# EAGLE design SwitchDemo4 (EAGLE 9.1.3)
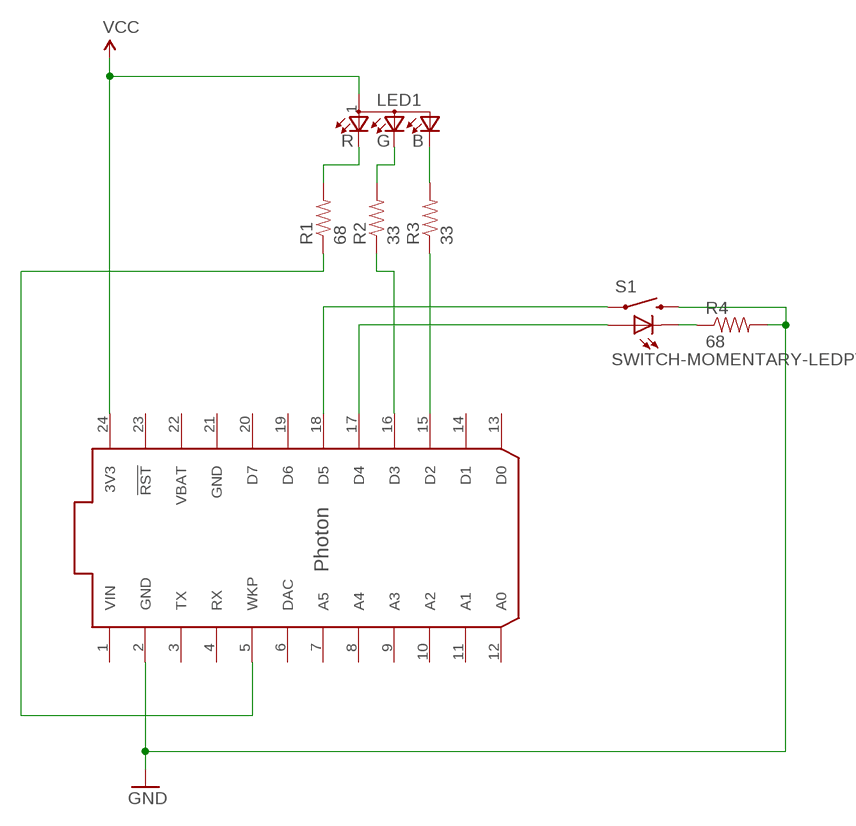
[diagram p0: schematic, sheet 1]

## Parts
LED1  LED-RGB-CREE-SMD  [LED-RGB-CREE-SMD]
R1  68  RES-68-0603.DEV  [0603-RES]
R2  33  RES-33-0603.DEV  [0603-RES]
R3  33  RES-33-0603.DEV  [0603-RES]
R4  68  RES-68-0603.DEV  [0603-RES]
S1  SWITCH-MOMENTARY-LEDPTH  [TACTILE-PTH-LED-12MM]
U$1  PHOTON  [PHOTON-SMD]

## Nets
BLED: LED1.2(B) R3.2
D2: R3.1 U$1.15(D2)
D3: R2.1 U$1.16(D3)
D4: S1.A U$1.17(D4)
D5: S1.4 U$1.18(D5)
GLED: LED1.3(G) R2.2
GND: R4.2 S1.2 U$1.2(GND)
RLED: LED1.4(R) R1.2
SLED: R4.1 S1.C
VCC: LED1.1(A) U$1.24(3V3)
WKP: R1.1 U$1.5(WKP)
Unconnected: U$1.3(TX) U$1.4(RX) U$1.6(DAC) U$1.7(A5) U$1.8(A4) U$1.9(A3) U$1.10(A2) U$1.11(A1) U$1.12(A0) U$1.13(D0) U$1.14(D1) U$1.19(D6) U$1.20(D7) U$1.23(!RST)

## Power pins joined to a net without a drawn wire
GND: U$1.21(GND)
VBAT: U$1.22(VBAT)
VIN: U$1.1(VIN)

## Library data of the parts
LED1 = rickk2:LED-RGB-CREE-SMD: LED RGB DIFFUSED 4SMD $ 0.35 Cree CLMVB-FKA-CFHEHLCBB7A363 2mm 4-PLCC common anode RGB LED https://www.digikey.com/product-detail/en/cree-inc/CLMVB-FKA-CFHEHLCBB7A363/CLMVB-FKA-CFHEHLCBB7A363CT-ND/6138627 Red=68 ohm, Green/Blue=33 ohm @ 3.3V
R1 R4 = rickk2:RES-68-0603.DEV: https://www.digikey.com/product-detail/en/panasonic-electronic-components/ERJ-3EKF68R0V/P68.0HCT-ND/1746805 Panasonic SMD 0603 1% 1/10W
R2 R3 = rickk2:RES-33-0603.DEV: https://www.digikey.com/product-detail/en/panasonic-electronic-components/ERJ-3EKF33R0V/P33.0HCT-ND/1746765 Panasonic SMD 0603 1% 1/10W
S1 = rickk2:SWITCH-MOMENTARY-LED: EZ is for Kits. There is no tStop (covering up the top side of the pads with mask). This helps the beginner see which side they should be soldering too. Red $2.10 https://www.sparkfun.com/products/10442 Also green, blue, and white Available in orange but I don't have that one
U$1 = rickk2:PHOTON: PPTC121LFBN-RC $ 0.98 Description CONN HEADER FEM 12POS.1" SGL TIN Expanded Description 12 Position Header Connector 0.100" (2.54mm) Through Hole Tin Digikey: S6100-ND Sullins: PPTC121LFBN-RC https://www.digikey.com/product-detail/en/sullins-connector-solutions/PPTC121LFBN-RC/S6100-ND/807231 SMD version $ 1.69 12 Position Header, Top or Bottom Entry Connector 0.100" (2.54mm) Surface Mount Tin Digikey: S5604-ND Sullins: NPTC121KFXC-RC Nylon/Phosphor Bronze / Tin / 0.1” / 12 Pos / 1 Row / Single Row SMT / SMT Single Row Pin 1 Left / ROHS Compliant https://www.digikey.com/product-detail/en/sullins-connector-solutions/NPTC121KFXC-RC/S5604-ND/776062

## Board
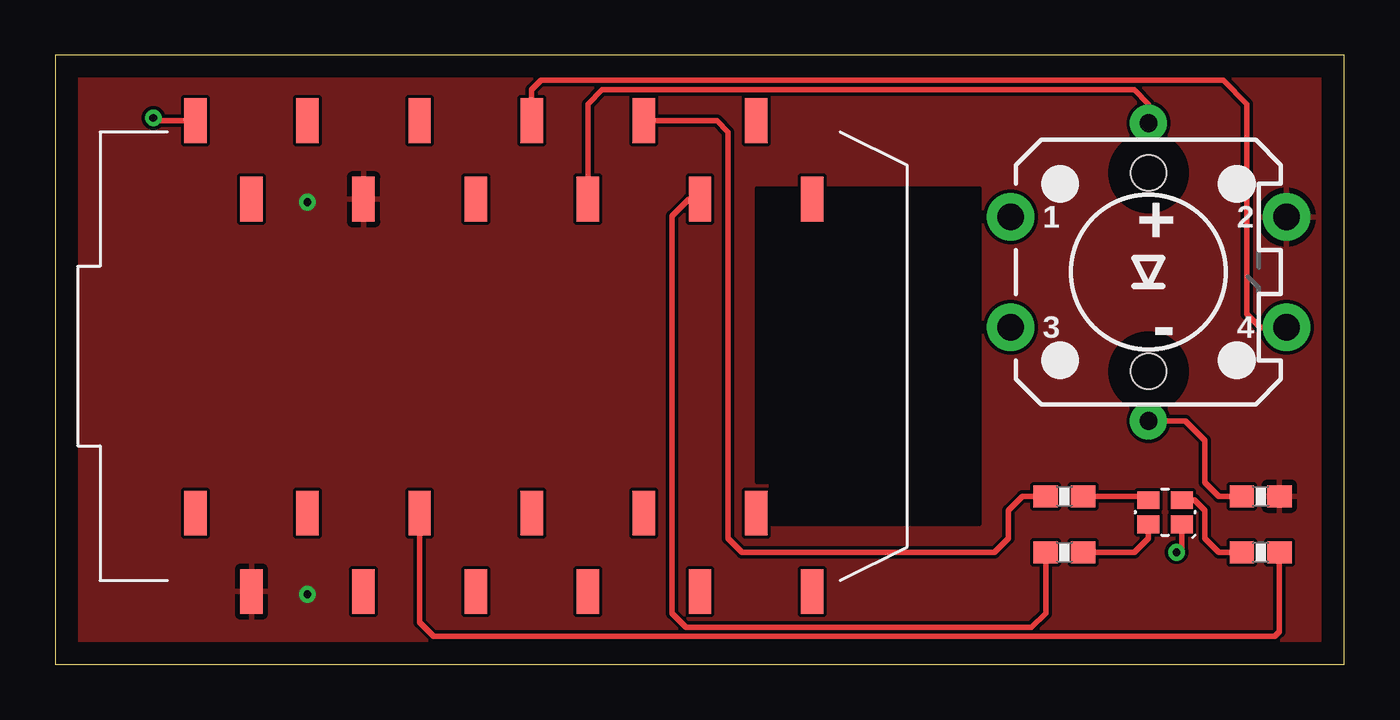
[diagram p1: board, top side]
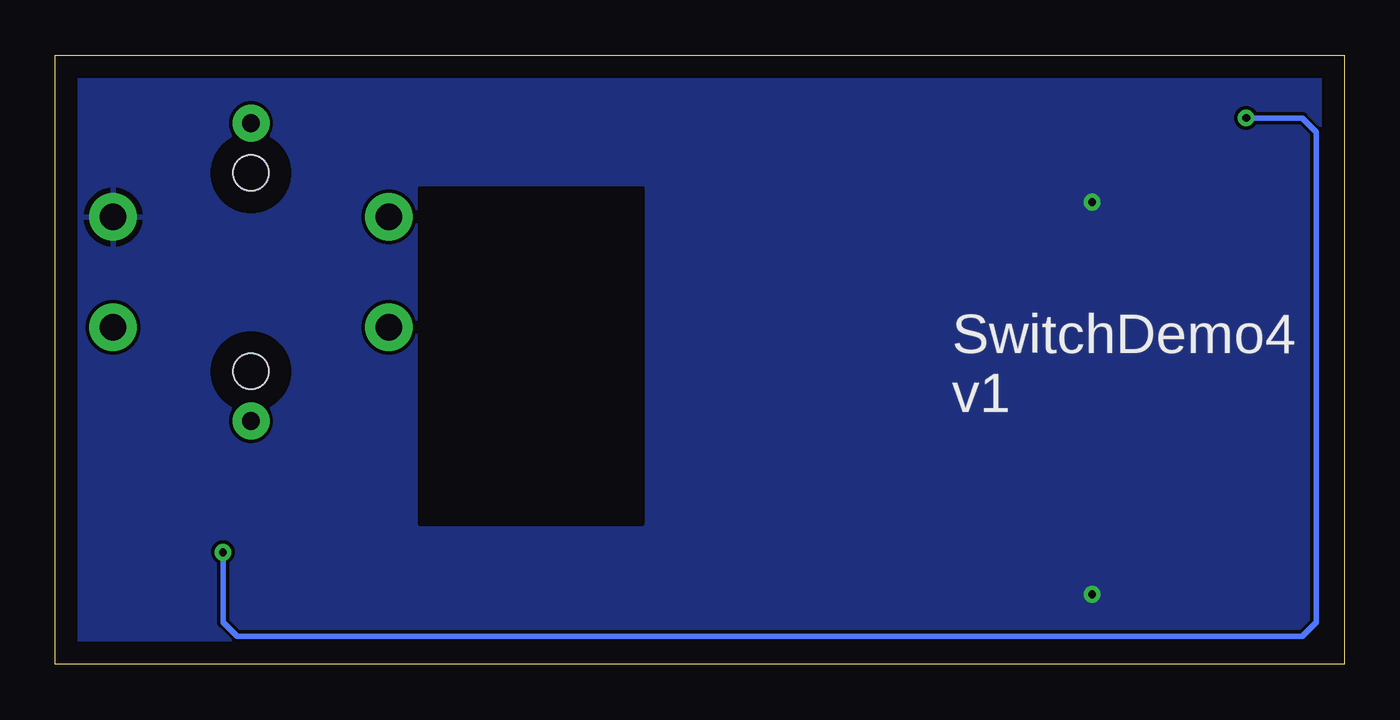
[diagram p2: board, bottom side, seen from below]

Size 58.4 x 27.61 mm. Coordinates in mm from the lower left corner, seen from the top.
Outline: 0,0 58.4,0 58.4,27.61 0,27.61 0,0
Copper layers (1*16): Top 0.035mm / dielectric 1.5mm / Bottom 0.035mm
Design rules "default": minimum track width 6mil, minimum drill 0.35mm, track to track 6mil, track to pad 6mil, pad to pad 6mil, via to via 6mil, smd to smd 6mil, copper to edge 40mil, drill to drill 6mil, minimum pad ring 10mil, minimum via ring 8mil, stop-mask expansion 4mil, vias tented up to drill 0mil, thermal gap 10mil

### Footprints (pad centres in the part's own frame; a part is rotated, then mirrored left to right if it is on the bottom)
LED-RGB-CREE-SMD = smd 1 x 0.8: 1 1.5,0; 2 0,0; 3 0,1.1; 4 1.5,1.1
0603-RES = smd 1.1 x 1: 1 -0.85,0; 2 0.85,0
TACTILE-PTH-LED-12MM = drill 1.2 pad 2.159: 1 -6.25,2.5; 2 6.25,2.5; 3 -6.25,-2.5; 4 6.25,-2.5 | drill 0.8 pad 1.676: A 0,6.75; C 0,-6.75 | hole 1.6: 0,4.5; 0,-4.5
PHOTON-SMD = smd 1.016 x 2.032: 1 0,1.778; 2 2.54,-1.778; 3 5.08,1.778; 4 7.62,-1.778; 5 10.16,1.778; 6 12.7,-1.778; 7 15.24,1.778; 8 17.78,-1.778; 9 20.32,1.778; 10 22.86,-1.778; 11 25.4,1.778; 12 27.94,-1.778; 13 27.94,16.002; 14 25.4,19.558; 15 22.86,16.002; 16 20.32,19.558; 17 17.78,16.002; 18 15.24,19.558; 19 12.7,16.002; 20 10.16,19.558; 21 7.62,16.002; 22 5.08,19.558; 23 2.54,16.002; 24 0,19.558

### Placement (x,y rotation side)
LED1  49.53,6.35 0 top
R1  54.61,5.08 180 top
R2  45.72,7.62 0 top
R3  45.72,5.08 0 top
R4  54.61,7.62 0 top
S1  49.53,17.78 0 top
U$1  6.35,5.08 0 top

### Tracks (layer width: path | path; a pad name or v marks a point on that pad's centre or on a via)
BLED
  Top 0.254: R3.2 48.9,5.08 49.53,5.71 LED1.2
D2
  Top 0.254: R3.1 44.87,2.33 44.22,1.68 28.57,1.68 27.94,2.31 27.94,20.32 28.7,21.08 U$1.15
D3
  Top 0.254: U$1.16 29.97,24.64 30.48,24.13 30.48,5.71 31.11,5.08 42.55,5.08 43.18,5.71 43.18,6.99 43.81,7.62 R2.1
D4
  Top 0.254: S1.A 49.53,25.4 48.9,26.04 24.77,26.04 24.13,25.4 U$1.17
D5
  Top 0.254: U$1.18 21.59,26.04 22.02,26.47 52.91,26.47 53.98,25.4 53.98,15.88 54.61,15.24 54.65,15.28 S1.4
GLED
  Top 0.254: R2.2 49.36,7.62 LED1.3
GND  (via drill 0.35)
  other vias: 11.43,20.95 11.43,3.17
  pour Top: 0,0 0,29.21 58.42,29.21 58.42,0
  pour Bottom: 0,0 0,30.48 58.42,30.48 58.42,0
RLED
  Top 0.254: LED1.4 51.6,7.45 52.07,6.99 52.07,5.71 52.7,5.08 R1.2
SLED
  Top 0.254: S1.C 51.2,11.03 52.07,10.16 52.07,8.26 52.7,7.62 R4.1
VCC  (via drill 0.35)
  Top 0.254: LED1.1 51.03,5.31 v50.8,5.08 | v4.45,24.77 4.57,24.64 U$1.24
  Bottom 0.254: v50.8,5.08 50.8,1.91 50.16,1.27 1.91,1.27 1.27,1.91 1.27,24.13 1.91,24.77 v4.45,24.77
WKP
  Top 0.254: R1.1 55.46,1.49 55.24,1.27 17.14,1.27 16.51,1.91 U$1.5

### Text on the board
bPlace: SwitchDemo4 / v1